# EAGLE schematic WBD_01 (EAGLE 9.6.2)
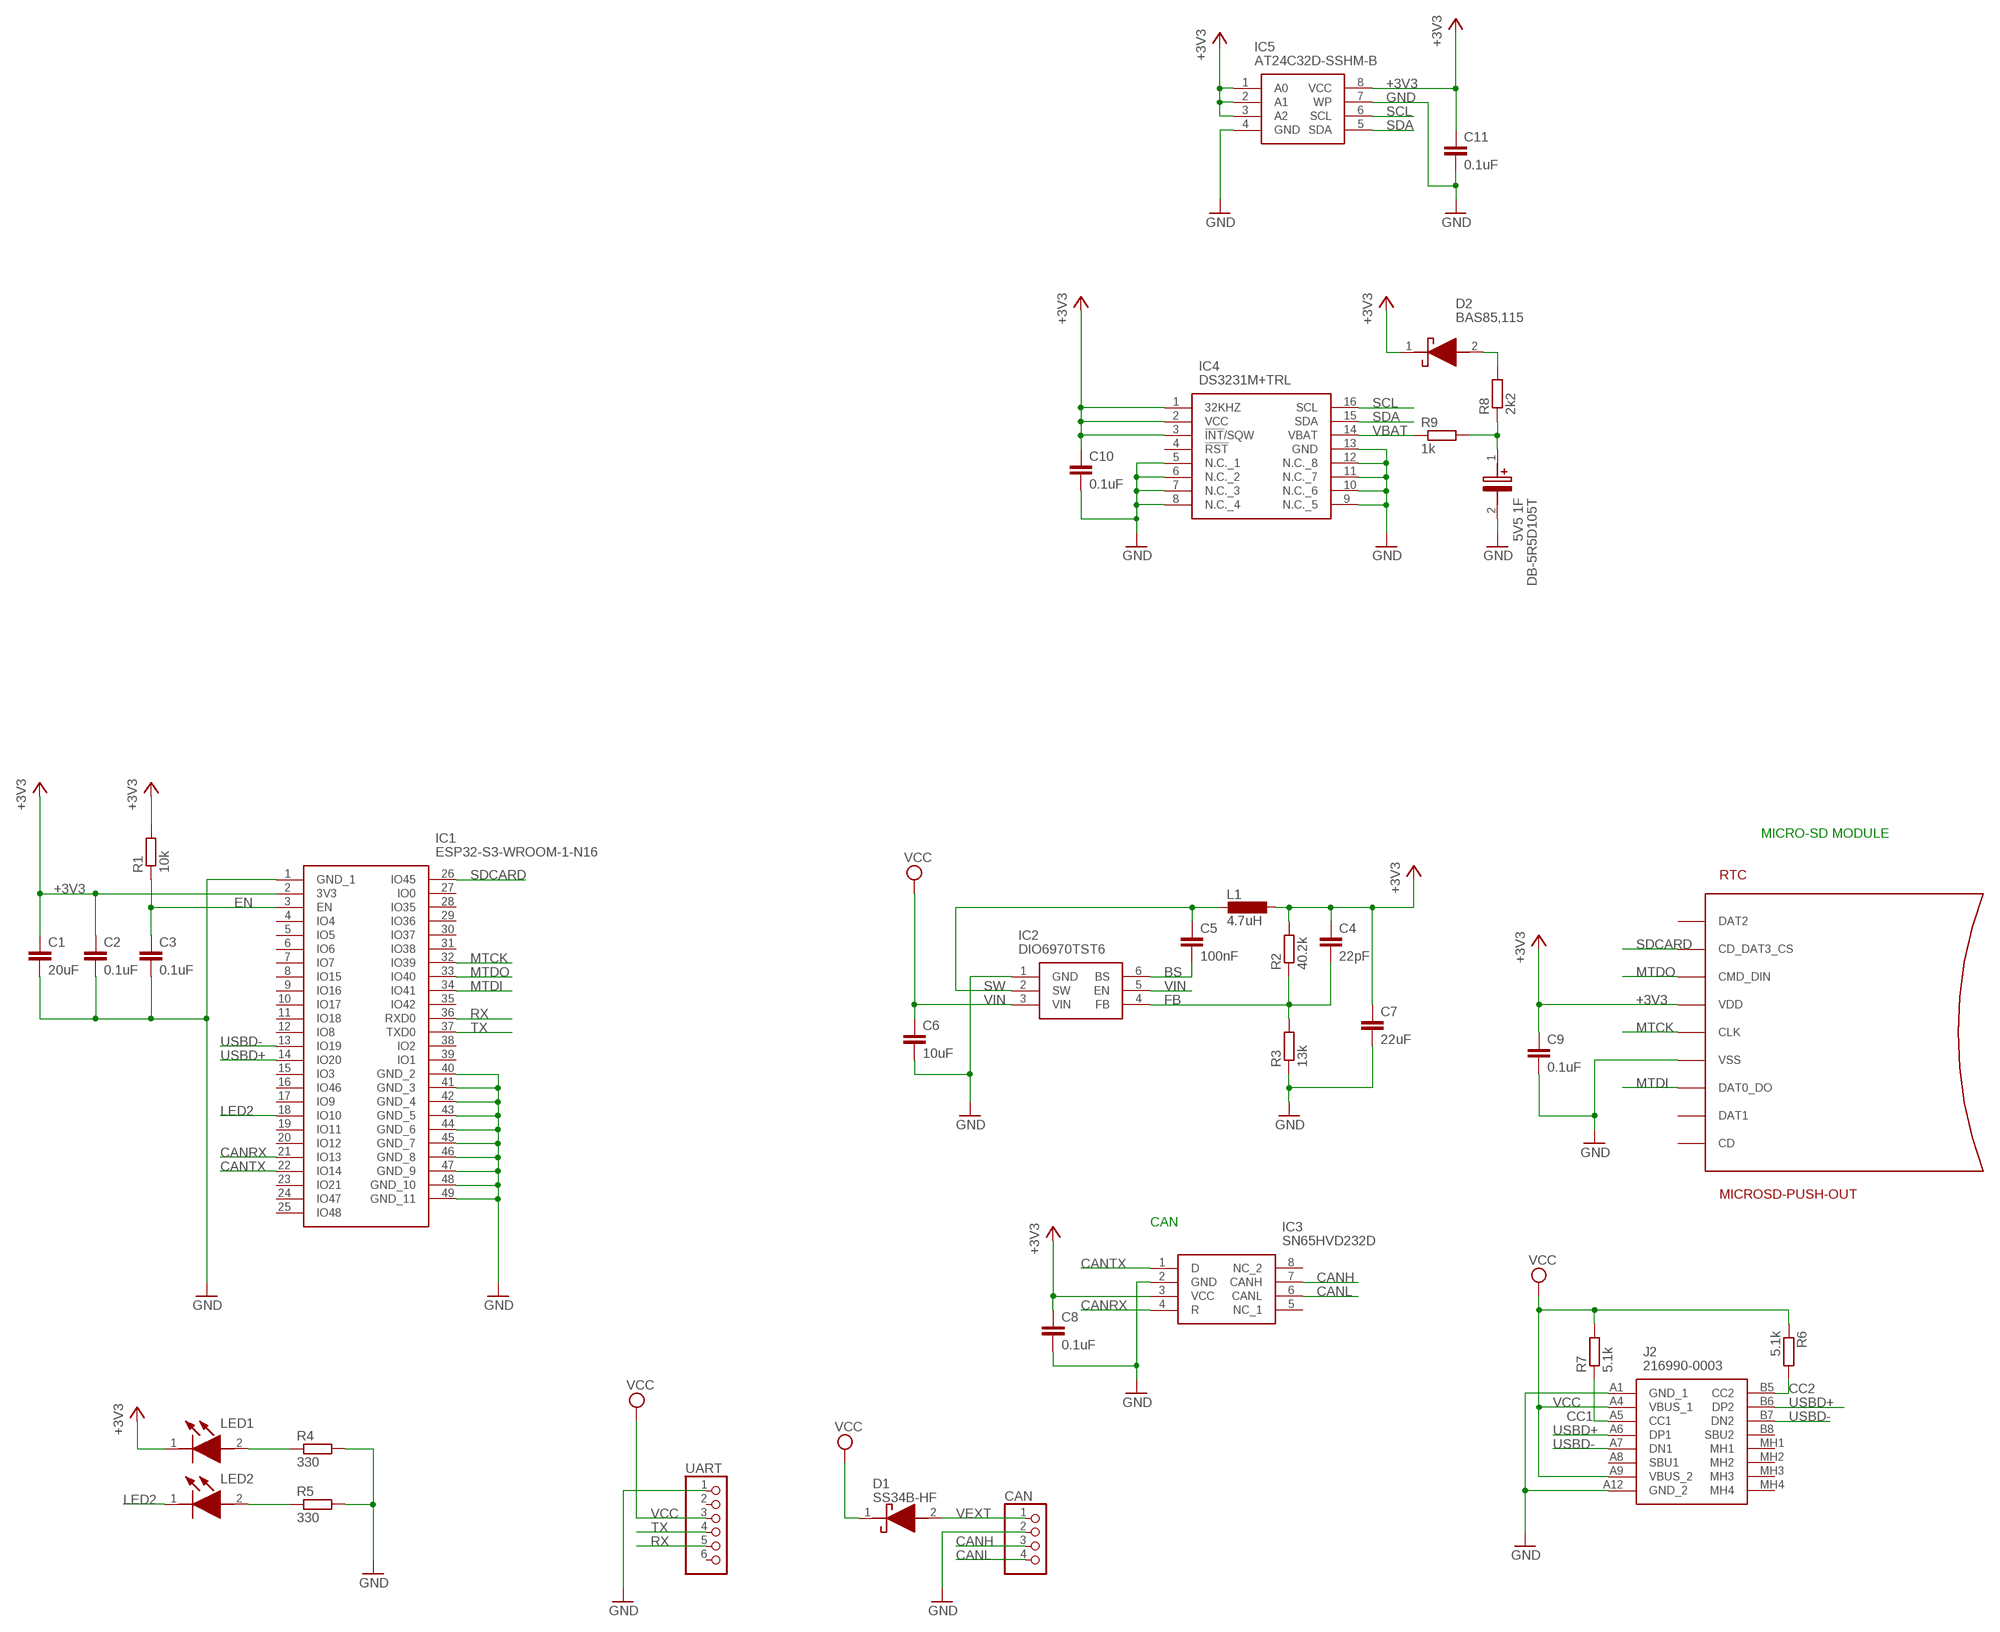
[diagram p0: schematic, sheet 1]

## Parts
C1  20uF  C-EUC0603  [C0603]
C2  0.1uF  C-EUC0603  [C0603]
C3  0.1uF  C-EUC0603  [C0603]
C4  22pF  C-EUC0603  [C0603]
C5  100nF  C-EUC0603  [C0603]
C6  10uF  C-EUC0603  [C0603]
C7  22uF  C-EUC0603  [C0603]
C8  0.1uF  C-EUC0603  [C0603]
C9  0.1uF  C-EUC0603  [C0603]
C10  0.1uF  C-EUC0603  [C0603]
C11  0.1uF  C-EUC0603  [C0603]
CAN  PINHD-1X4M  [1X04M]
D1  SS34B-HF  [DIOM5336X320N]
D2  BAS85,115  [BAS85115]
DB-5R5D105T  5V5 1F  DB-5R5D105T  [CAPPRD500W130D2150H800]
IC1  ESP32-S3-WROOM-1-N16  [ESP32S3WROOM1N16]
IC2  DIO6970TST6  [SOT95P280X90-6N]
IC3  SN65HVD232D  [SOIC127P600X175-8N]
IC4  DS3231M+TRL  [SOIC127P1032X265-16N]
IC5  AT24C32D-SSHM-B  [SOIC127P600X175-8N]
J2  216990-0003  [2169900003]
L1  4.7uH  L-EUL5650M  [L5650M]
LED1  150060GS75000  [LEDC1608X80N]
LED2  150060GS75000  [LEDC1608X80N]
R1  10k  R-EU_R0603  [R0603]
R2  40.2k  R-EU_R0603  [R0603]
R3  13k  R-EU_R0603  [R0603]
R4  330  R-EU_R0603  [R0603]
R5  330  R-EU_R0603  [R0603]
R6  5.1k  R-EU_R0603  [R0603]
R7  5.1k  R-EU_R0603  [R0603]
R8  2k2  R-EU_R0603  [R0603]
R9  1k  R-EU_R0603  [R0603]
RTC  MICROSD-PUSH-OUT  [MICROSD-PUSH-OUT]
UART  PINHD-1X6M  [1X06M]

## Nets
+3V3: C1.1 C2.1 C4.1 C7.1 C8.1 C9.1 C10.1 C11.1 D2.1(K) IC1.2(3V3) IC3.3(VCC) IC4.1(32KHZ) IC4.2(VCC) IC4.3(!INT!/SQW) IC5.1(A0) IC5.2(A1) IC5.3(A2) IC5.8(VCC) L1.1 LED1.1(K) R1.2 R2.2 RTC.4(VDD)
BS: C5.2 IC2.6(BS)
CANH: CAN.3 IC3.7(CANH)
CANL: CAN.4 IC3.6(CANL)
CANRX: IC1.21(IO13) IC3.4(R)
CANTX: IC1.22(IO14) IC3.1(D)
CC1: J2.A5(CC1) R7.1
CC2: J2.B5(CC2) R6.2
EN: C3.1 IC1.3(EN) R1.1
FB: C4.2 IC2.4(FB) R2.1 R3.2
GND: C1.2 C2.2 C3.2 C6.2 C7.2 C8.2 C9.2 C10.2 C11.2 CAN.2 DB-5R5D105T.2(-) IC1.1(GND_1) IC1.40(GND_2) IC1.41(GND_3) IC1.42(GND_4) IC1.43(GND_5) IC1.44(GND_6) IC1.45(GND_7) IC1.46(GND_8) IC1.47(GND_9) IC1.48(GND_10) IC1.49(GND_11) IC2.1(GND) IC3.2(GND) IC4.5(N.C._1) IC4.6(N.C._2) IC4.7(N.C._3) IC4.8(N.C._4) IC4.9(N.C._5) IC4.10(N.C._6) IC4.11(N.C._7) IC4.12(N.C._8) IC4.13(GND) IC5.4(GND) IC5.7(WP) J2.A1(GND_1) J2.A12(GND_2) R3.1 R4.2 R5.2 RTC.6(VSS) RTC.G1(VSS) RTC.G2(VSS) RTC.G3(VSS) RTC.G4(VSS) UART.1
LDR1: LED1.2(A) R4.1
LDR2: LED2.2(A) R5.1
LED2: IC1.18(IO10) LED2.1(K)
MTCK: IC1.32(IO39) RTC.5(CLK)
MTDI: IC1.34(IO41) RTC.7(DAT0_DO)
MTDO: IC1.33(IO40) RTC.3(CMD_DIN)
RTCBAT: DB-5R5D105T.1(+) R8.1 R9.2
RTCD: D2.2(A) R8.2
RX: IC1.36(RXD0) UART.5
SCL: IC4.16(SCL) IC5.6(SCL)
SDA: IC4.15(SDA) IC5.5(SDA)
SDCARD: IC1.26(IO45) RTC.2(CD_DAT3_CS)
SW: C5.1 IC2.2(SW) L1.2
TX: IC1.37(TXD0) UART.4
USBD+: IC1.14(IO20) J2.A6(DP1) J2.B6(DP2)
USBD-: IC1.13(IO19) J2.A7(DN1) J2.B7(DN2)
VBAT: IC4.14(VBAT) R9.1
VCC: D1.1(K) J2.A4(VBUS_1) J2.A9(VBUS_2) R6.1 R7.2 UART.3
VEXT: CAN.1 D1.2(A)
VIN: C6.1 IC2.3(VIN) IC2.5(EN) ; supply symbol labelled VCC
Unconnected: IC1.4(IO4) IC1.5(IO5) IC1.6(IO6) IC1.7(IO7) IC1.8(IO15) IC1.9(IO16) IC1.10(IO17) IC1.11(IO18) IC1.12(IO8) IC1.15(IO3) IC1.16(IO46) IC1.17(IO9) IC1.19(IO11) IC1.20(IO12) IC1.23(IO21) IC1.24(IO47) IC1.25(IO48) IC1.27(IO0) IC1.28(IO35) IC1.29(IO36) IC1.30(IO37) IC1.31(IO38) IC1.35(IO42) IC1.38(IO2) IC1.39(IO1) IC3.5(NC_1) IC3.8(NC_2) IC4.4(!RST) J2.A8(SBU1) J2.B8(SBU2) J2.MH1 J2.MH2 J2.MH3 J2.MH4 RTC.1(DAT2) RTC.8(DAT1) RTC.CD UART.2 UART.6

## Notes on the sheet
- MICRO-SD MODULE
- CAN

## Library data of the parts
C1-C11 = rcl:C-EU: CAPACITOR, European symbol
CAN = pinhead:PINHD-1X4: PIN HEADER
D1 = SamacSys_Parts:SS34B-HF: Schottky Diodes & Rectifiers DIODE SCHOTTKY 3A 40V SMB Source: Datasheet <https://www.mouser.jp/datasheet/2/80/SP-JB017_SS34B-HF_Thru._SS320B-HF_RevB-1847021.pdf>; DESCRIPTION: Schottky Diodes & Rectifiers DIODE SCHOTTKY 3A 40V SMB; HEIGHT: 3.2mm; MANUFACTURER_NAME: Comchip Technology; MANUFACTURER_PART_NUMBER: SS34B-HF; MOUSER_PART_NUMBER: 750-SS34B-HF; MOUSER_PRICE-STOCK: https://www.mouser.co.uk/ProductDetail/Comchip-Technology/SS34B-HF?qs=vmHwEFxEFR9G1M%252BcUPG%2FxQ%3D%3D
D2 = SamacSys_Parts:BAS85,115: Schottky Diodes & Rectifiers SCHOTTKY 30V 200MA Source: Datasheet <https://assets.nexperia.com/documents/data-sheet/BAS85.pdf>; DESCRIPTION: Schottky Diodes & Rectifiers SCHOTTKY 30V 200MA; HEIGHT: 1.6mm; MANUFACTURER_NAME: Nexperia; MANUFACTURER_PART_NUMBER: BAS85,115; MOUSER_PART_NUMBER: 771-BAS85-T/R; MOUSER_PRICE-STOCK: https://www.mouser.co.uk/ProductDetail/Nexperia/BAS85115?qs=me8TqzrmIYWCmVXtgUH2Gg%3D%3D
DB-5R5D105T = SamacSys_Parts:DB-5R5D105T: Supercapacitors / Ultracapacitors MEM CAP 5.5V 1.0F Source: Datasheet; DESCRIPTION: Supercapacitors / Ultracapacitors MEM CAP 5.5V 1.0F; HEIGHT: 8mm; MANUFACTURER_NAME: Elna; MANUFACTURER_PART_NUMBER: DB-5R5D105T; MOUSER_PART_NUMBER: 555-DB-5R5D105T; MOUSER_PRICE-STOCK: https://www.mouser.co.uk/ProductDetail/Elna/DB-5R5D105T?qs=r8OyiFxb6Rcu1BWmqcONIQ%3D%3D
IC1 = ESP32-S3-WROOM-1-N16:ESP32-S3-WROOM-1-N16: WiFi Modules - 802.11 [Engineering Samples] SMD Module, ESP32-S3, 16 MB SPI Flash, PCB Antenna Source: Datasheet <https://www.espressif.com/sites/default/files/documentation/esp32-s3-wroom-1_wroom-1u_datasheet_en.pdf>; DESCRIPTION: WiFi Modules - 802.11 [Engineering Samples] SMD Module, ESP32-S3, 16 MB SPI Flash, PCB Antenna; HEIGHT: 3.25mm; MANUFACTURER_NAME: Espressif Systems; MANUFACTURER_PART_NUMBER: ESP32-S3-WROOM-1-N16; MOUSER_PART_NUMBER: 356-ESP32S3WROOM1N16; MOUSER_PRICE-STOCK: https://www.mouser.co.uk/ProductDetail/Espressif-Systems/ESP32-S3-WROOM-1-N16?qs=Li%252BoUPsLEntjPrtJwwS5Pw%3D%3D
IC2 = SamacSys_Parts:DIO6970TST6: Switching Voltage Regulators 2A Step Converter 24V Input Sync Source: Datasheet; DESCRIPTION: Switching Voltage Regulators 2A Step Converter 24V Input Sync; HEIGHT: 0.9mm; MANUFACTURER_NAME: DIOO Microcircuits; MANUFACTURER_PART_NUMBER: DIO6970TST6; MOUSER_PART_NUMBER: 453-DIO6970ST6; MOUSER_PRICE-STOCK: https://www.mouser.co.uk/ProductDetail/DIOO-Microcircuits/DIO6970TST6?qs=%252BEew9%252B0nqrCWpKu8WqElxA%3D%3D
IC3 = SamacSys_Parts:SN65HVD232D: CAN Transceiver 1Mbit/s ISO 11898, 8-Pin SOIC Source: Datasheet <http://www.ti.com/lit/ds/symlink/sn65hvd232.pdf>; DESCRIPTION: CAN Transceiver 1Mbit/s ISO 11898, 8-Pin SOIC; HEIGHT: 1.75mm; MANUFACTURER_NAME: Texas Instruments; MANUFACTURER_PART_NUMBER: SN65HVD232D; MOUSER_PART_NUMBER: 595-SN65HVD232D; MOUSER_PRICE-STOCK: https://www.mouser.co.uk/ProductDetail/Texas-Instruments/SN65HVD232D?qs=QViXGNcIEAueLIS9b8IyYg%3D%3D
IC4 = SamacSys_Parts:DS3231M+TRL: +/-5ppm, I2C Real-Time Clock Source: Datasheet <http://componentsearchengine.com/Datasheets/1/DS3231M TRL.pdf>; DESCRIPTION: +/-5ppm, I2C Real-Time Clock; HEIGHT: 2.65mm; MANUFACTURER_NAME: Maxim Integrated; MANUFACTURER_PART_NUMBER: DS3231M+TRL; MOUSER_PART_NUMBER: 700-DS3231M+TRL; MOUSER_PRICE-STOCK: https://www.mouser.co.uk/ProductDetail/Maxim-Integrated/DS3231M%2bTRL?qs=Bakm8ERcljq5PBzSwLfmgg%3D%3D
IC5 = SamacSys_Parts:AT24C32D-SSHM-B: AT24C32D-SSHM-B, EEPROM Memory 32kbit,, 4096 x, 8bit, Serial-2 Wire, 550ns 1.7 5.5 V, 8-Pin SOIC Source: Datasheet <http://www.atmel.com/images/atmel-8866-seeprom-at24c32d-datasheet.pdf>; DESCRIPTION: AT24C32D-SSHM-B, EEPROM Memory 32kbit,, 4096 x, 8bit, Serial-2 Wire, 550ns 1.7 5.5 V, 8-Pin SOIC; HEIGHT: 1.75mm; MANUFACTURER_NAME: Microchip; MANUFACTURER_PART_NUMBER: AT24C32D-SSHM-B; MOUSER_PART_NUMBER: 556-AT24C32D-SSHM-B; MOUSER_PRICE-STOCK: https://www.mouser.co.uk/ProductDetail/Microchip-Technology-Atmel/AT24C32D-SSHM-B?qs=ZZMt4ii29sN2mTRLl%2FnVJA%3D%3D
J2 = SamacSys_Parts:216990-0003: USB Connectors Mid-Mnt SMT CH0.58 16Ckt Type C Rec. Source: Datasheet <https://www.molex.com/pdm_docs/sd/2169900003_sd.pdf>; DESCRIPTION: USB Connectors Mid-Mnt SMT CH0.58 16Ckt Type C Rec.; HEIGHT: 3.36mm; MANUFACTURER_NAME: Molex; MANUFACTURER_PART_NUMBER: 216990-0003; MOUSER_PART_NUMBER: 538-216990-0003; MOUSER_PRICE-STOCK: https://www.mouser.co.uk/ProductDetail/Molex/216990-0003?qs=DRkmTr78QASn0GILUGAYCA%3D%3D
L1 = rcl:L-EU: INDUCTOR, European symbol; SPICEPREFIX: L
LED1 LED2 = SamacSys_Parts:150060GS75000: Wurth Elektronik WL-SMCW 520 nm Green LED, 1608 (0603) Clear SMD package Source: Datasheet <https://componentsearchengine.com/Datasheets/2/150060GS75000.pdf>; DESCRIPTION: Wurth Elektronik WL-SMCW 520 nm Green LED, 1608 (0603) Clear SMD package; HEIGHT: 0.8mm; MANUFACTURER_NAME: Wurth Elektronik; MANUFACTURER_PART_NUMBER: 150060GS75000; MOUSER_PART_NUMBER: 710-150060GS75000; MOUSER_PRICE-STOCK: https://www.mouser.co.uk/ProductDetail/Wurth-Elektronik/150060GS75000?qs=LlUlMxKIyB0UYkq5lDO8nA%3D%3D
R1-R9 = rcl:R-EU_: RESISTOR, European symbol; SPICEPREFIX: R
RTC = microsd:MICROSD-PUSH-OUT: T-Flash Push-Out Micro SD Card Reader 14.75mm x 14.5mm SMD with external pins
UART = pinhead:PINHD-1X6: PIN HEADER